# EAGLE design driver ckt_speed (EAGLE 8.4.3)
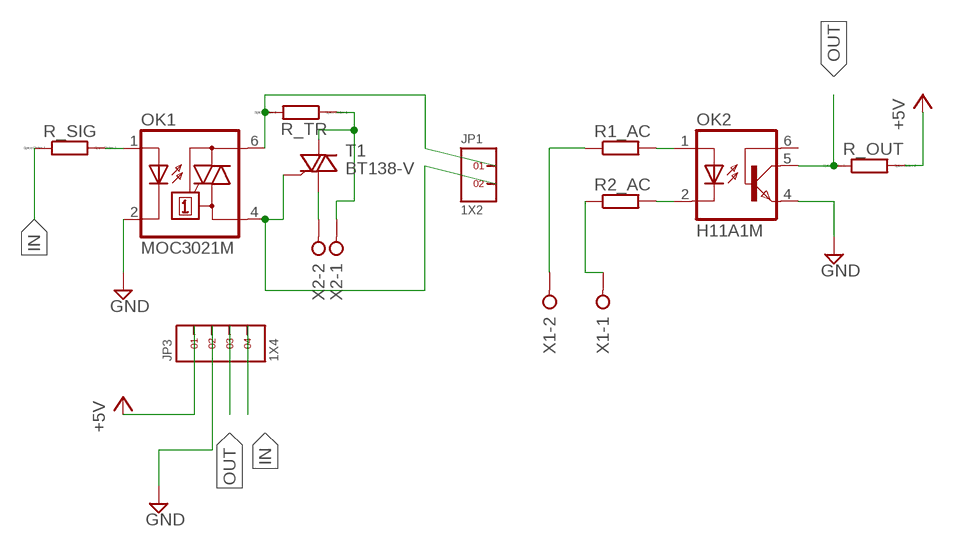
[diagram p0: schematic, sheet 1]

## Parts
JP1  1X2  [1X2]
JP3  1X4  [1X4]
OK1  MOC3021M  [DIL06]
OK2  H11A1M  [DIL06]
R1_AC  R-EU_0411/15  [0411/15]
R2_AC  R-EU_0411/15  [0411/15]
R_OUT  RR1206  [R1206]
R_SIG  RR1206  [R1206]
R_TR  RR1206  [R1206]
T1  BT138-V  [TO220BV]
X1  W237-02P  [W237-132]
X2  W237-02P  [W237-132]

## Nets
+5V: JP3.1 R_OUT.2
AC1: R1_AC.1 X1.2
GND: JP3.2 OK1.2(C) OK2.4(EMI)
IN: JP3.4 R_SIG.1
N$1: JP1.1 OK1.6(A2) R_TR.2
N$2: R_TR.1 T1.T2(A2) X2.1
N$3: T1.T1(A1) X2.2
N$4: OK1.1(A) R_SIG.2
N$5: OK2.1(A) R1_AC.2
N$6: OK2.2(C) R2_AC.2
N$7: JP1.2 OK1.4(A1) T1.G
N$8: R2_AC.1 X1.1
OUT: JP3.3 OK2.5(COL) R_OUT.1
Unconnected: OK2.6(BAS)

## Library data of the parts
JP1 = headers(2mm):1X2
JP3 = headers(2mm):1X4
OK1 = optocoupler:MOC30*M: RANDOM-PHASE OPTOISOLATORS TRIAC DRIVER OUTPUT Source: http://www.fairchildsemi.com MOC3020-M.pdf; MF: FAIRCHILD SEMICONDUCTOR; MPN: MOC3021-M; OC_FARNELL: 1021365; OC_NEWARK: 95B7895
OK2 = optocoupler:H11A*?M: General Purpose 6-Pin Phototransistor Optocouplers Source: http://www.fairchildsemi.com/ds/4N/4N35-M.pdf; MPN: H11A1-M; OC_FARNELL: 1021358; OC_NEWARK: 97K1793
R1_AC R2_AC = resistor:R-EU_: RESISTOR, European symbol
R_OUT R_SIG R_TR = eagle-ltspice:R: RESISTOR, European symbol; SPICEMODEL: NONE; SPICEPREFIX: R
T1 = triac:BT138: TRIAC Source: http://www.semiconductors.philips.com BT138_SERIES_2.pdf
X1 X2 = con-wago-508:W237-02P: WAGO SREW CLAMP; OC_FARNELL: unknown; OC_NEWARK: unknown

## Board
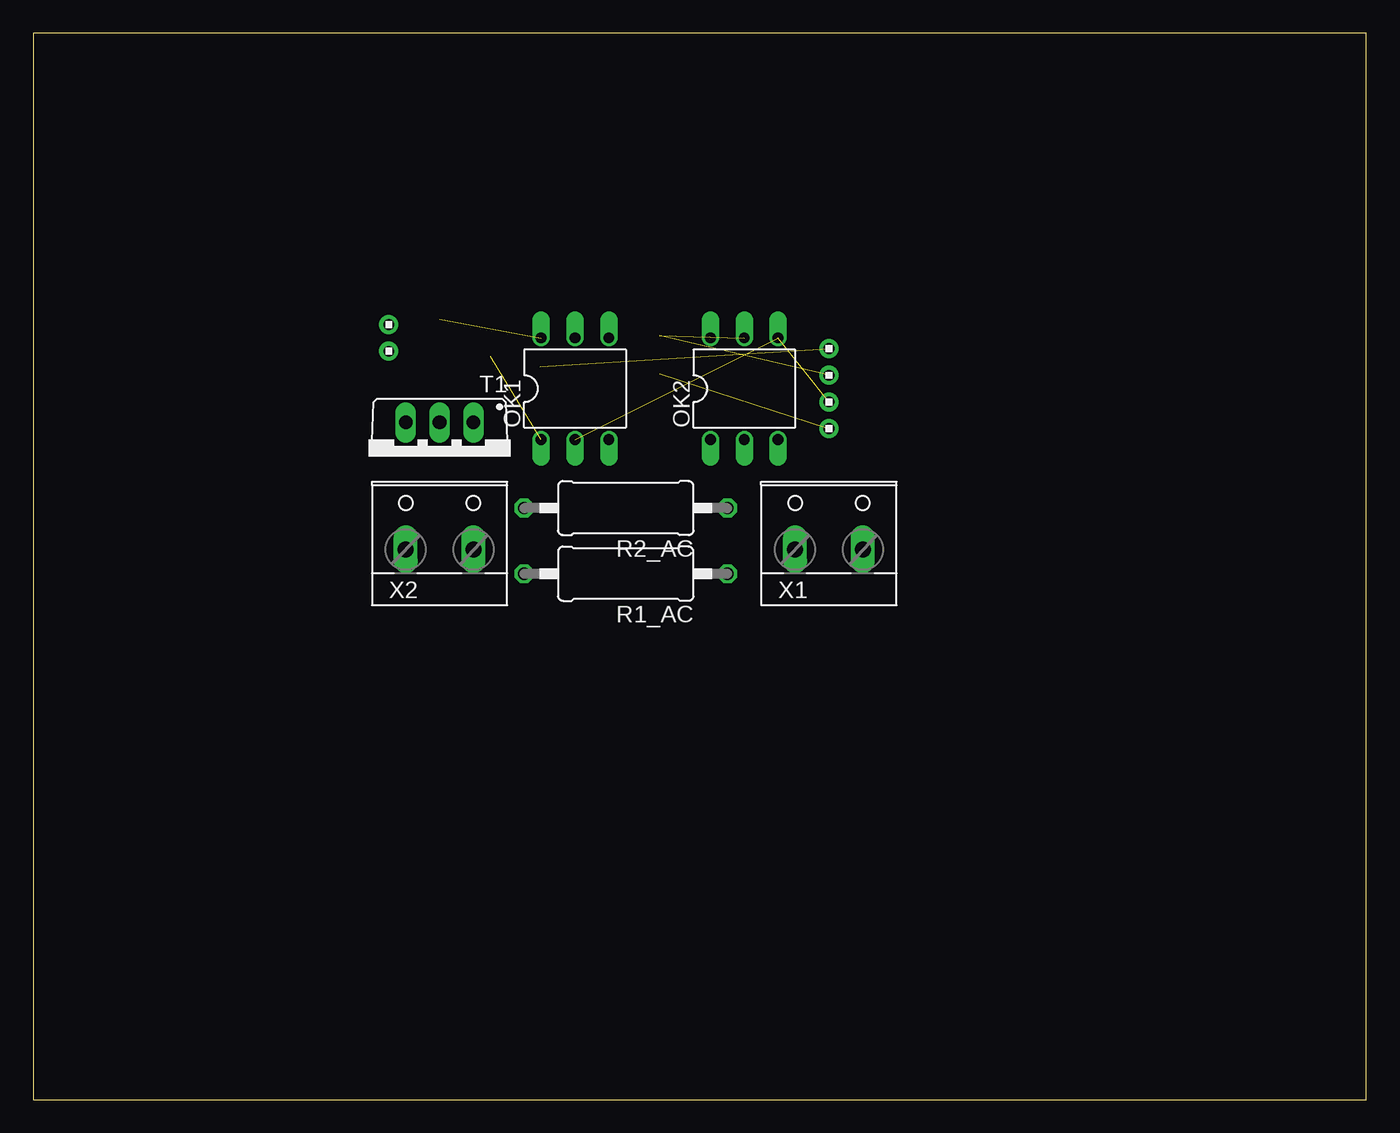
[diagram p1: board, top side]
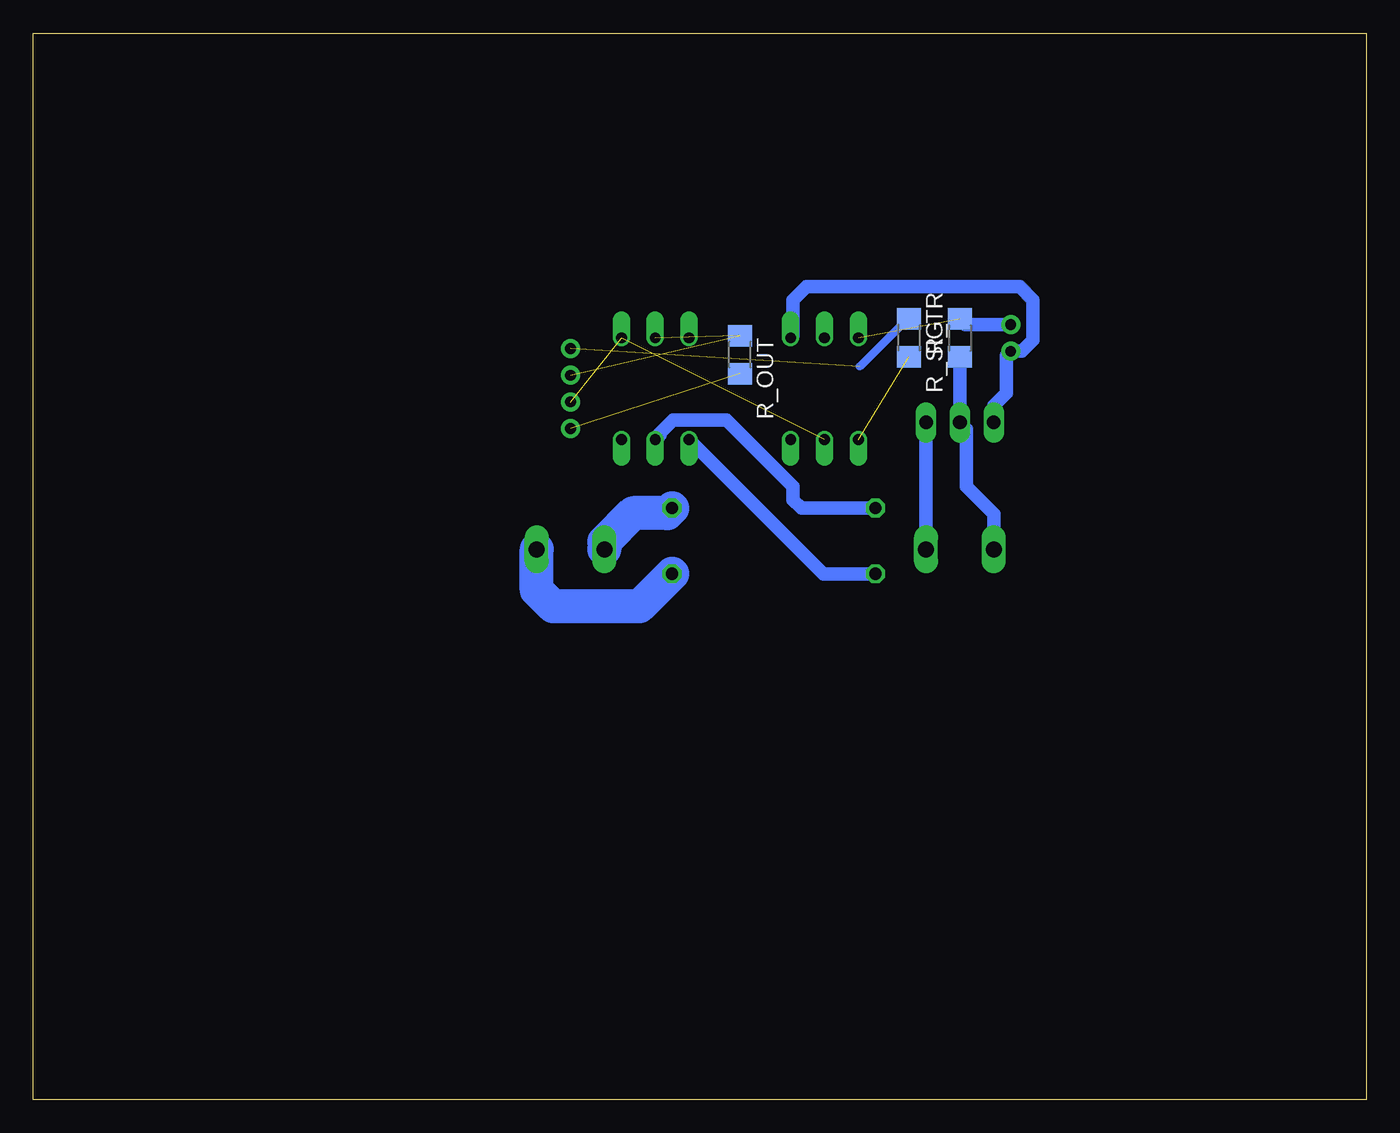
[diagram p2: board, bottom side, seen from below]

Size 100 x 80 mm. Coordinates in mm from the lower left corner, seen from the top.
Outline: 0,0 100,0 100,80 0,80 0,0
Copper layers (1*16): Top 0.035mm / dielectric 1.5mm / Bottom 0.035mm
Design rules "default": minimum track width 6mil, minimum drill 0.35mm, track to track 6mil, track to pad 6mil, pad to pad 6mil, via to via 6mil, smd to smd 6mil, copper to edge 40mil, drill to drill 6mil, minimum pad ring 10mil, minimum via ring 8mil, stop-mask expansion 4mil, vias tented up to drill 0mil, thermal gap 10mil

### Footprints (pad centres in the part's own frame; a part is rotated, then mirrored left to right if it is on the bottom)
1X2 = drill 0.8 pad 1.422: 1 -1,0; 2 1,0
1X4 = drill 0.8 pad 1.422: 1 -3,0; 2 -1,0; 3 1,0; 4 3,0
DIL06 = drill 0.813 offset: 1 -2.54,-3.81; 2 0,-3.81; 3 2.54,-3.81; 4 2.54,3.81; 5 0,3.81; 6 -2.54,3.81
0411/15 = drill 0.914 octagon: 1 -7.62,0; 2 7.62,0
R1206 = smd 1.6 x 1.803: 1 -1.422,0; 2 1.422,0
TO220BV = drill 1.016 long: G 2.54,-2.54; T1 -2.54,-2.54; T2 0,-2.54
W237-132 = drill 1.194 long: 1 -2.54,-0.635; 2 2.54,-0.635

### Placement (x,y rotation side)
JP1  26.67,57.15 270 top
JP3  59.69,53.34 90 top
OK1  40.64,53.34 0 top
OK2  53.34,53.34 0 top
R1_AC  44.45,39.45 180 top
R2_AC  44.45,44.37 180 top
R_OUT  46.99,55.88 270 bottom
R_SIG  34.29,57.15 270 bottom
R_TR  30.48,57.15 90 bottom
T1  30.48,48.26 180 top
X1  59.69,41.91 0 top
X2  30.48,41.91 0 top

### Tracks (layer width: path | path; a pad name or v marks a point on that pad's centre or on a via)
+5V  (1 unrouted)
AC1
  Bottom 2.54: R1_AC.1 54.52,37 61,37 62.23,38.23 X1.2
GND  (2 unrouted)
IN  (1 unrouted)
  Bottom 0.61: R_SIG.1 34.43,58.57 38,55
N$1  (1 unrouted)
  Bottom 1.016: JP1.1 30.06,58.15 R_TR.2
N$2
  Bottom 1.016: X2.1 27.94,43.94 30,46 30,50.32 T1.T2 R_TR.1
N$3
  Bottom 1.016: T1.T1 X2.2
N$4  (1 unrouted)
N$5
  Bottom 1.016: OK2.1 40.72,39.45 R1_AC.2
N$6
  Bottom 1.016: OK2.2 53,49.87 53,50 52,51 48,51 43,46 43,45 42.37,44.37 R2_AC.2
N$7
  Bottom 1.016: T1.G 27.94,52.06 27,53 27,55.82 JP1.2 25.85,56.15 25,57 25,60 26,61 42,61 43,60 43,57.33 OK1.4
N$8
  Bottom 2.54: R2_AC.1 52.44,44 55,44 57.15,41.85 X1.1
OUT  (2 unrouted)